# EAGLE design carte_Moteurs (EAGLE 9.6.2)
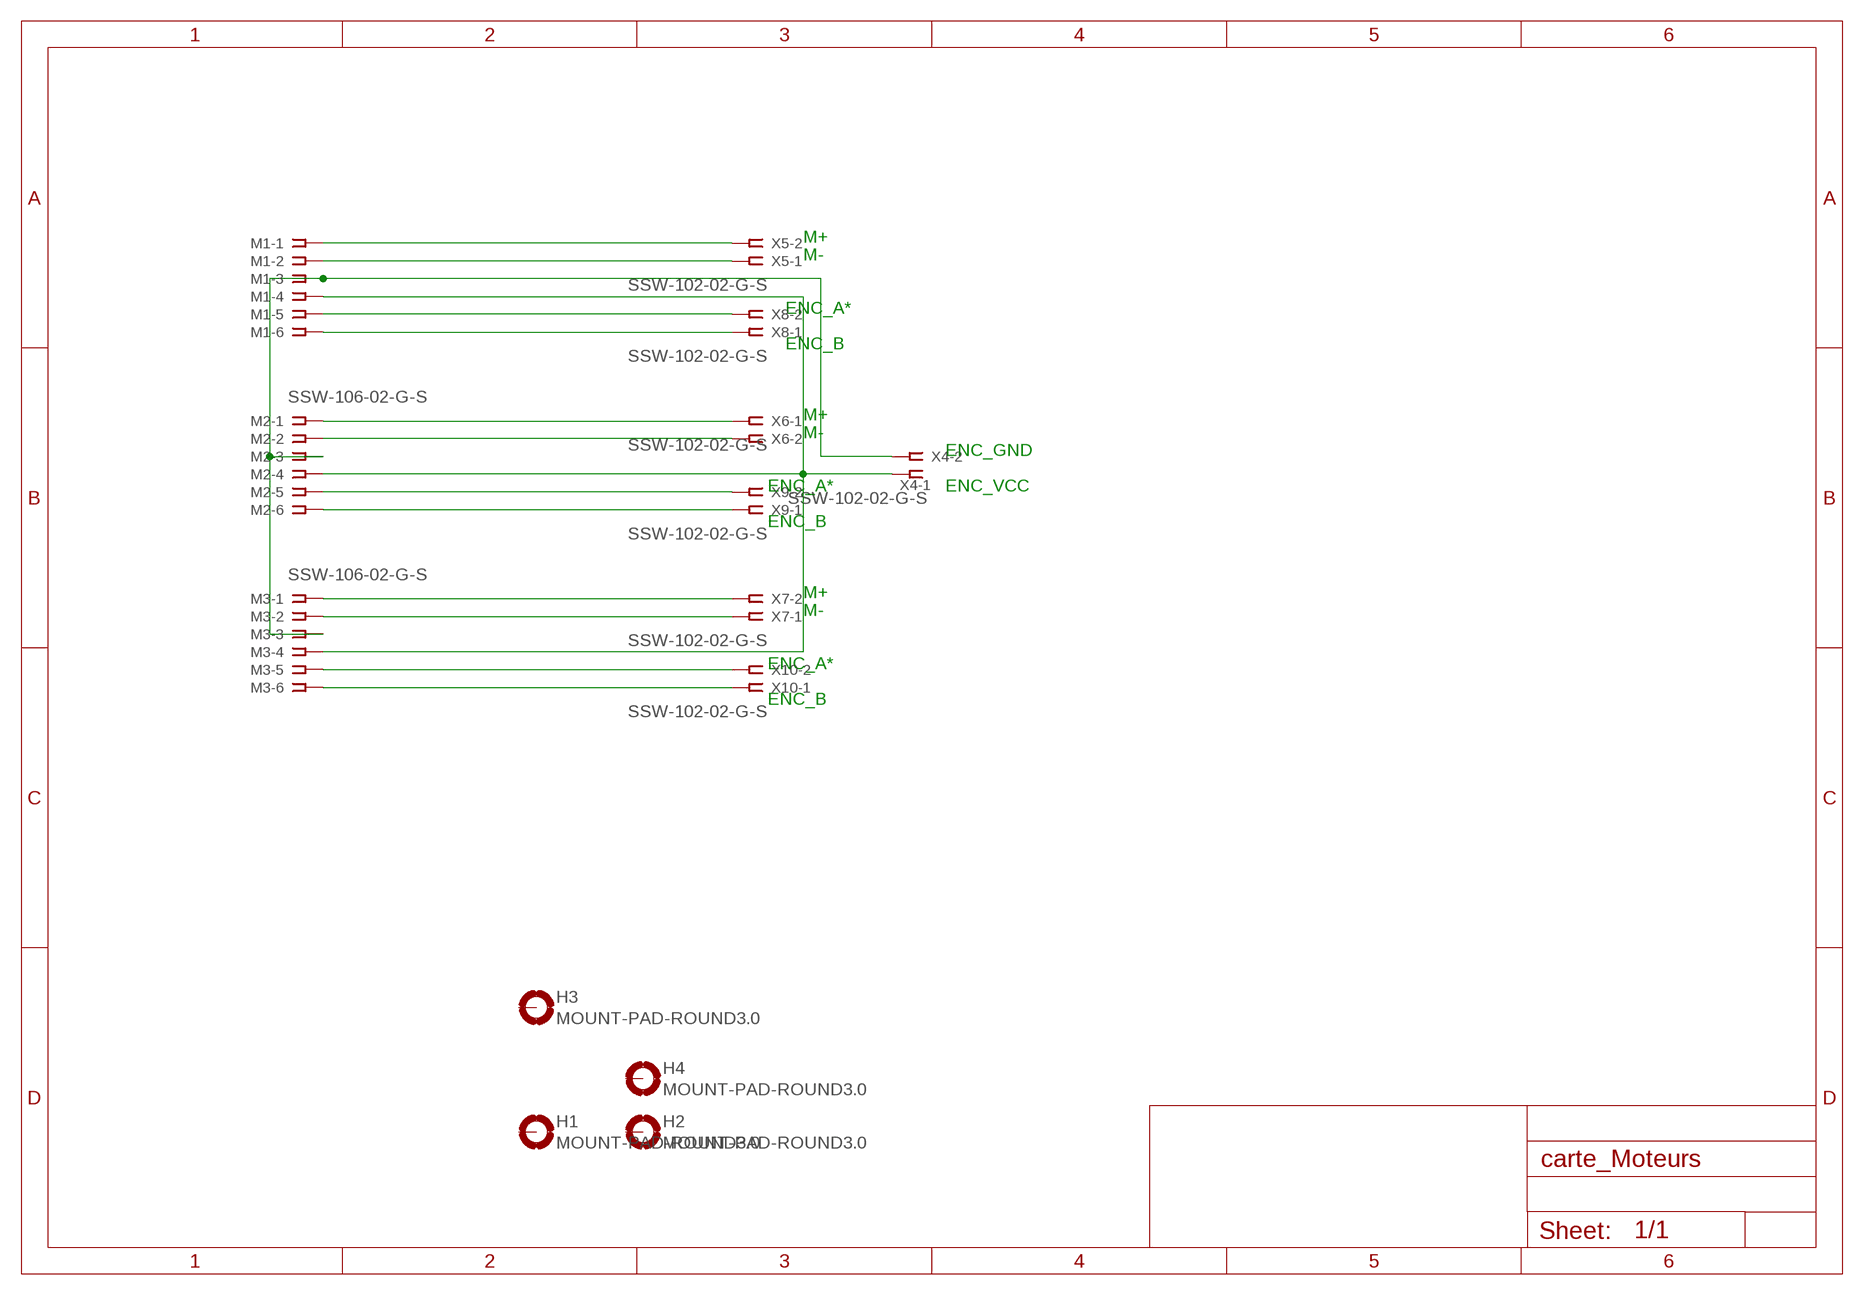
[diagram p0: schematic, sheet 1]

## Parts
H1  MOUNT-PAD-ROUND3.0  [3,0-PAD]
H2  MOUNT-PAD-ROUND3.0  [3,0-PAD]
H3  MOUNT-PAD-ROUND3.0  [3,0-PAD]
H4  MOUNT-PAD-ROUND3.0  [3,0-PAD]
M1  SSW-106-02-G-S  [SSW-106-02-G-S]
M2  SSW-106-02-G-S  [SSW-106-02-G-S]
M3  SSW-106-02-G-S  [SSW-106-02-G-S]
X4  SSW-102-02-G-S  [SSW-102-02-G-S]
X5  SSW-102-02-G-S  [SSW-102-02-G-S]
X6  SSW-102-02-G-S  [SSW-102-02-G-S]
X7  SSW-102-02-G-S  [SSW-102-02-G-S]
X8  SSW-102-02-G-S  [SSW-102-02-G-S]
X9  SSW-102-02-G-S  [SSW-102-02-G-S]
X10  SSW-102-02-G-S  [SSW-102-02-G-S]

## Nets
N$1: M1.1 X5.2
N$2: M1.2 X5.1
N$3: M2.1 X6.1
N$4: M2.2 X6.2
N$5: M3.1 X7.2
N$6: M3.2 X7.1
N$7: M1.6 X8.1
N$8: M1.5 X8.2
N$9: M2.5 X9.2
N$10: M2.6 X9.1
N$11: M3.5 X10.2
N$12: M3.6 X10.1
N$13: M1.3 M2.3 M3.3 X4.2
N$14: M1.4 M2.4 M3.4 X4.1
Unconnected: H1.B3,0(MOUNT) H2.B3,0(MOUNT) H3.B3,0(MOUNT) H4.B3,0(MOUNT)

## Notes on the sheet
- M+
- M-
- ENC_A*
- ENC_B
- M+
- M-
- ENC_GND
- ENC_A* | ENC_VCC
- ENC_B
- M+
- M-
- ENC_A*
- ENC_B

## Library data of the parts
H1-H4 = holes:MOUNT-PAD-ROUND: MOUNTING PAD, round; PART_DESC: VIS M3x6 TETE FENDUE CYLINDRIQUE; SORTED: V
M1 = con-samtec:SSW-106-02-G-S: THROUGH-HOLE .025" SQ POST SOCKET Source: Samtec SSW.pdf; MF: Samtec Inc.; MPN: Motor1; OC_FARNELL: unknown; OC_NEWARK: 11P9416
M2 M3 = con-samtec:SSW-106-02-G-S: THROUGH-HOLE .025" SQ POST SOCKET Source: Samtec SSW.pdf; MF: Samtec Inc.; MPN: SSW-106-02-G-S; OC_FARNELL: unknown; OC_NEWARK: 11P9416
X4-X10 = con-samtec:SSW-102-02-G-S: THROUGH-HOLE .025" SQ POST SOCKET Source: Samtec SSW.pdf; MF: Samtec Inc.; MPN: SSW-102-02-G-S; OC_FARNELL: unknown; OC_NEWARK: 11P9351

## Board
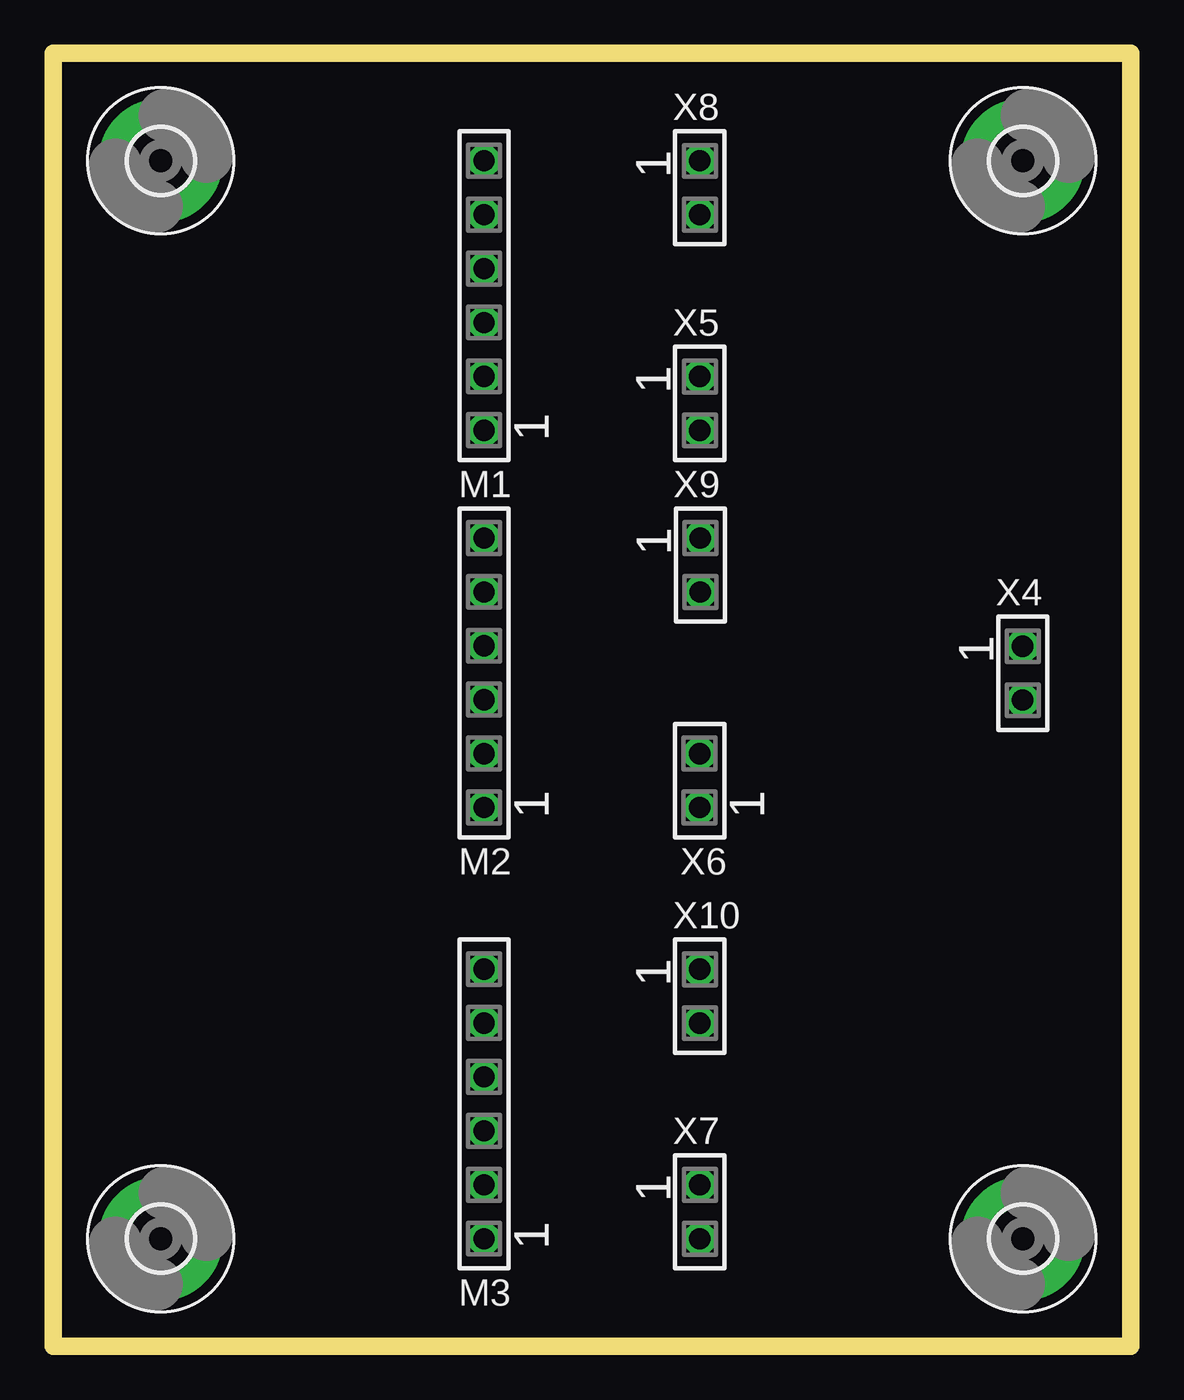
[diagram p1: board, top side]
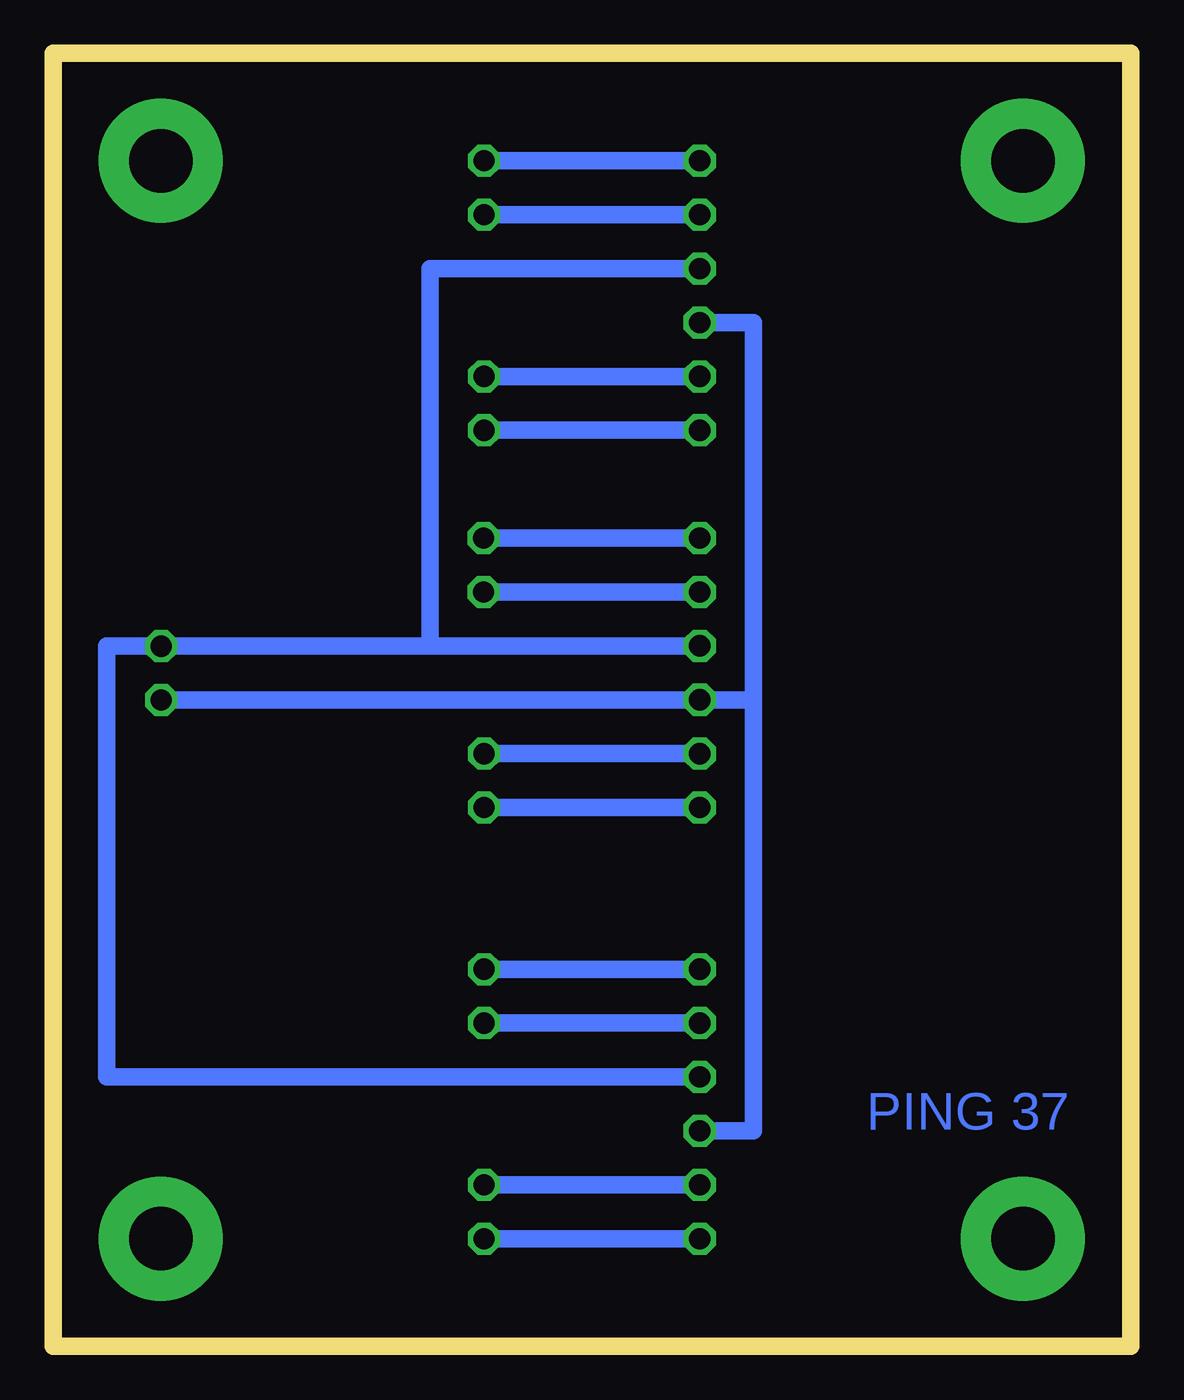
[diagram p2: board, bottom side, seen from below]

Size 50.8 x 60.96 mm. Coordinates in mm from the lower left corner, seen from the top.
Outline: 0,0 50.8,0 50.8,60.96 0,60.96 0,0
Copper layers (1*16): Top 0.035mm / dielectric 1.5mm / Bottom 0.035mm
Design rules "default": minimum track width 6mil, minimum drill 0.35mm, track to track 6mil, track to pad 6mil, pad to pad 6mil, via to via 6mil, smd to smd 6mil, copper to edge 40mil, drill to drill 6mil, minimum pad ring 10mil, minimum via ring 8mil, stop-mask expansion 4mil, vias tented up to drill 0mil, thermal gap 10mil

### Footprints (pad centres in the part's own frame; a part is rotated, then mirrored left to right if it is on the bottom)
3,0-PAD = drill 3 pad 5.842: B3,0 0,0
SSW-106-02-G-S = drill 1 pad 1.5 octagon: 1 -6.35,0; 2 -3.81,0; 3 -1.27,0; 4 1.27,0; 5 3.81,0; 6 6.35,0
SSW-102-02-G-S = drill 1 pad 1.5 octagon: 1 -1.27,0; 2 1.27,0

### Placement (x,y rotation side)
H1  5.08,5.08 0 top
H2  45.72,5.08 0 top
H3  5.08,55.88 0 top
H4  45.72,55.88 0 top
M1  20.32,49.53 90 top
M2  20.32,31.75 90 top
M3  20.32,11.43 90 top
X4  45.7,31.73 270 top
X5  30.48,44.45 270 top
X6  30.48,26.67 90 top
X7  30.48,6.35 270 top
X8  30.48,54.61 270 top
X9  30.51,36.83 270 top
X10  30.48,16.51 270 top

### Tracks (layer width: path | path; a pad name or v marks a point on that pad's centre or on a via)
N$1
  Bottom 0.813: X5.2 M1.1
N$2
  Bottom 0.813: X5.1 M1.2
N$3
  Bottom 0.813: X6.1 M2.1
N$4
  Bottom 0.813: X6.2 M2.2
N$5
  Bottom 0.813: X7.2 M3.1
N$6
  Bottom 0.813: X7.1 M3.2
N$7
  Bottom 0.813: M1.6 X8.1
N$8
  Bottom 0.813: M1.5 X8.2
N$9
  Bottom 0.813: X9.2 M2.5
N$10
  Bottom 0.813: M2.6 X9.1
N$11
  Bottom 0.813: X10.2 M3.5
N$12
  Bottom 0.813: M3.6 X10.1
N$13
  Bottom 0.813: X4.2 20.34,30.46 M2.3 17.78,30.48 | M3.3 17.78,10.16 17.78,30.48 | M1.3 17.78,48.26 17.78,30.48
N$14
  Bottom 0.813: M2.4 33.02,33.02 | 33.02,33.02 45.69,33.02 | 45.69,33.02 X4.1 | M3.4 48.26,12.7 48.26,33.02 45.69,33.02 | M1.4 33.02,50.8 33.02,33.02

### Text on the board
Bottom: PING 37